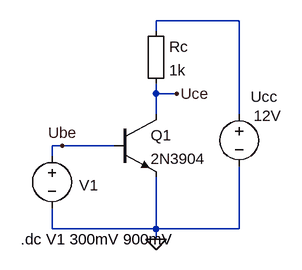
[diagram p0: schematic BT-CE-SWITCH-modes.asc]
BT-CE-SWITCH-modes.asc, the LTspice schematic file:
Version 4
SHEET 1 880 680
WIRE 336 -64 208 -64
WIRE 208 -48 208 -64
WIRE 208 48 208 32
WIRE 240 48 208 48
WIRE 208 80 208 48
WIRE 336 80 336 -64
WIRE 64 128 48 128
WIRE 144 128 64 128
WIRE 48 144 48 128
WIRE 48 256 48 224
WIRE 208 256 208 176
WIRE 208 256 48 256
WIRE 336 256 336 160
WIRE 336 256 208 256
WIRE 208 272 208 256
FLAG 208 272 0
FLAG 64 128 Ube
FLAG 240 48 Uce
SYMBOL Misc\\EuropeanResistor 192 -64 R0
SYMATTR InstName Rc
SYMATTR Value 1k
SYMBOL voltage 48 128 R0
WINDOW 3 -4 148 Invisible 2
WINDOW 123 0 0 Left 2
WINDOW 39 0 0 Left 2
WINDOW 0 42 61 Left 2
SYMATTR Value 0
SYMATTR InstName V1
SYMBOL voltage 336 64 R0
WINDOW 3 22 18 Left 2
WINDOW 123 0 0 Left 2
WINDOW 39 0 0 Left 2
WINDOW 0 18 -11 Left 2
SYMATTR Value 12V
SYMATTR InstName Ucc
SYMBOL npn 144 80 R0
SYMATTR InstName Q1
SYMATTR Value 2N3904
TEXT 0 272 Left 2 !.dc V1 300mV 900mV

The netlist it stands for:
* BT-CE-SWITCH-modes.asc
Rc N001 Uce 1k
V1 Ube 0 0
V§Ucc N001 0 12V
Q1 Uce Ube 0 0 2N3904
.model NPN NPN
.model PNP PNP
.lib standard.bjt
.dc V1 300mV 900mV
.backanno
.end